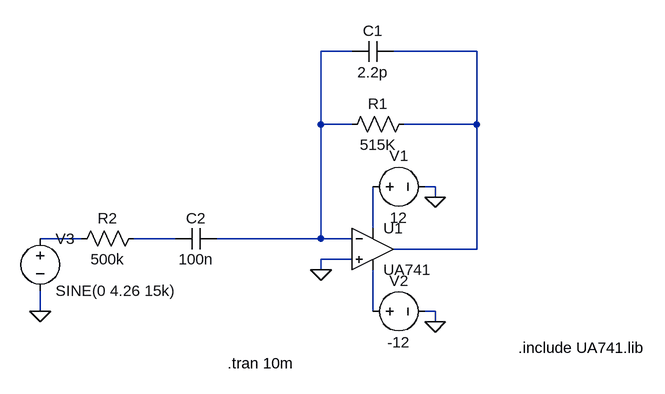
[diagram p0: schematic FILTER.asc]
FILTER.asc, the LTspice schematic file:
Version 4.1
SHEET 1 880 680
WIRE 192 -128 144 -128
WIRE 384 -128 256 -128
WIRE 144 -16 144 -128
WIRE 192 -16 144 -16
WIRE 384 -16 384 -128
WIRE 384 -16 272 -16
WIRE 320 80 304 80
WIRE 320 96 320 80
WIRE 224 144 224 80
WIRE -224 160 -288 160
WIRE -80 160 -144 160
WIRE 144 160 144 -16
WIRE 144 160 -16 160
WIRE 192 160 144 160
WIRE 384 176 384 -16
WIRE 384 176 256 176
WIRE 192 192 144 192
WIRE 144 208 144 192
WIRE -288 272 -288 240
WIRE 224 272 224 208
WIRE 320 272 304 272
WIRE 320 288 320 272
FLAG 320 96 0
FLAG 320 288 0
FLAG -288 272 0
FLAG 144 208 0
SYMBOL OpAmps\\opamp2 224 112 R0
SYMATTR InstName U1
SYMATTR Value UA741
SYMBOL voltage 208 80 R270
WINDOW 0 32 56 VTop 2
WINDOW 3 -32 56 VBottom 2
SYMATTR InstName V1
SYMATTR Value 12
SYMBOL voltage 208 272 R270
WINDOW 0 32 56 VTop 2
WINDOW 3 -32 56 VBottom 2
SYMATTR InstName V2
SYMATTR Value -12
SYMBOL res 288 -32 R90
WINDOW 0 0 56 VBottom 2
WINDOW 3 32 56 VTop 2
SYMATTR InstName R1
SYMATTR Value 515K
SYMBOL cap 256 -144 R90
WINDOW 0 0 32 VBottom 2
WINDOW 3 32 32 VTop 2
SYMATTR InstName C1
SYMATTR Value 2.2p
SYMBOL voltage -288 144 R0
WINDOW 123 0 0 Left 0
WINDOW 39 0 0 Left 0
SYMATTR InstName V3
SYMATTR Value SINE(0 4.26 15k)
SYMBOL res -128 144 R90
WINDOW 0 0 56 VBottom 2
WINDOW 3 32 56 VTop 2
SYMATTR InstName R2
SYMATTR Value 500k
SYMBOL cap -16 144 R90
WINDOW 0 0 32 VBottom 2
WINDOW 3 32 32 VTop 2
SYMATTR InstName C2
SYMATTR Value 100n
TEXT 448 328 Left 2 !.include UA741.lib
TEXT 0 352 Left 2 !.tran 10m

The netlist it stands for:
* FILTER.asc
X§U1 0 N001 N003 N006 N002 UA741  ; pins In+ In- V+ V- OUT
V1 N003 0 12
V2 N006 0 -12
R1 N002 N001 515K
C1 N002 N001 2.2p
V3 N004 0 SINE(0 4.26 15k)
R2 N005 N004 500k
C2 N001 N005 100n
.include UA741.lib
.tran 10m
.backanno
.end